# Altium schematic sheet Batt_Meas.SchDoc
size B
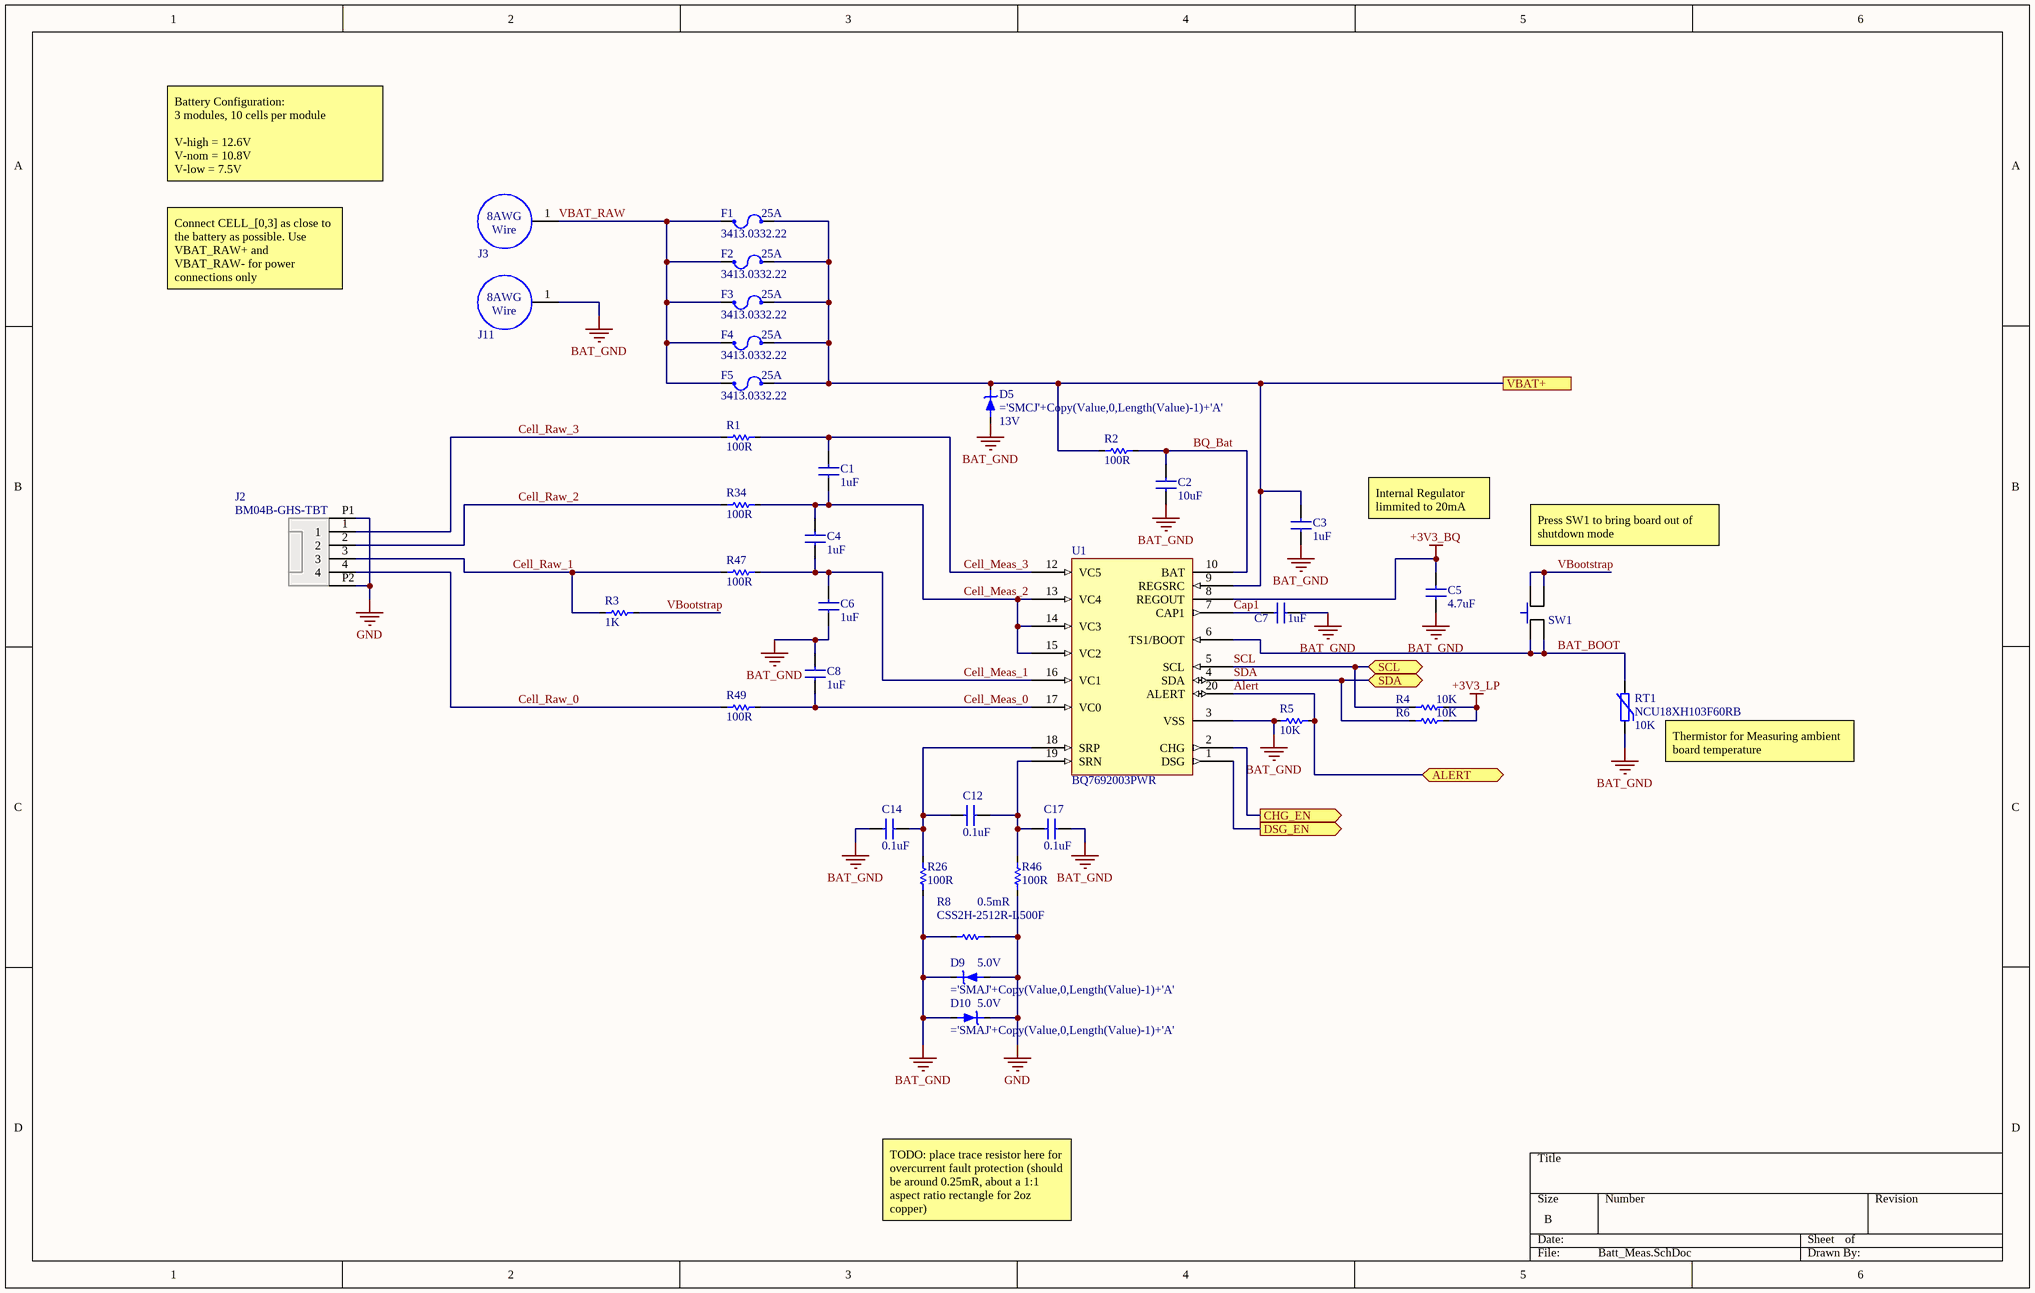
[diagram p0: Batt_Meas.SchDoc]

## Parts
C1  value 1uF  [0603_CAPACITOR]  (hidden comment: CAP 1uF 16V X7R)
C2  value 10uF  [1206_CAPACITOR]  (hidden comment: CAP 10uF 50V X5R)
C3  value 1uF  [0603_CAPACITOR]  (hidden comment: CAP 1uF 16V X7R)
C4  value 1uF  [0603_CAPACITOR]  (hidden comment: CAP 1uF 16V X7R)
C5  value 4.7uF  [0603_Capacitor]  (hidden comment: CAP 4.7uF 6.3V X5R)
C6  value 1uF  [0603_CAPACITOR]  (hidden comment: CAP 1uF 16V X7R)
C7  value 1uF  [0805_Capacitor]  (hidden comment: CAP 1uF 16V X7R)
C8  value 1uF  [0603_CAPACITOR]  (hidden comment: CAP 1uF 16V X7R)
C12  value 0.1uF  [0402_CAPACITOR]  (hidden comment: CAP 0.1uF 16V X7R)
C14  value 0.1uF  [0402_CAPACITOR]  (hidden comment: CAP 0.1uF 16V X7R)
C17  value 0.1uF  [0402_CAPACITOR]  (hidden comment: CAP 0.1uF 16V X7R)
D5  value 13V  [SMC]  (hidden comment: TVS Diode)
D9  value 5.0V  [SMA]  (hidden comment: TVS Diode)
D10  value 5.0V  [SMA]  (hidden comment: TVS Diode)
F1  3413.0332.22  value 25A  [1206_Fuse]
F2  3413.0332.22  value 25A  [1206_Fuse]
F3  3413.0332.22  value 25A  [1206_Fuse]
F4  3413.0332.22  value 25A  [1206_Fuse]
F5  3413.0332.22  value 25A  [1206_Fuse]
J2  BM04B-GHS-TBT  [J_BM04B-GHS-TBT]
J3  8AWG Wire To Board  [Wire_To_Board_8AWG_Red]  (value not drawn)
J11  8AWG Wire To Board  [Wire_To_Board_8AWG_Black]  (value not drawn)
R1  value 100R  [0402_Resistor]  (hidden comment: R_0402_100R_1%)
R2  value 100R  [0402_Resistor]  (hidden comment: R_0402_100R_1%)
R3  value 1K  [0402_Resistor]  (hidden comment: R_0402_1K_1%)
R4  value 10K  [0402_Resistor]  (hidden comment: R_0402_10K_1%)
R5  value 10K  [0402_Resistor]  (hidden comment: R_0402_10K_1%)
R6  value 10K  [0402_Resistor]  (hidden comment: R_0402_10K_1%)
R8  CSS2H-2512R-L500F  value 0.5mR  [2512_Resistor]
R26  value 100R  [0402_Resistor]  (hidden comment: R_0402_100R_1%)
R34  value 100R  [0402_Resistor]  (hidden comment: R_0402_100R_1%)
R46  value 100R  [0402_Resistor]  (hidden comment: R_0402_100R_1%)
R47  value 100R  [0402_Resistor]  (hidden comment: R_0402_100R_1%)
R49  value 100R  [0402_Resistor]  (hidden comment: R_0402_100R_1%)
RT1  NCU18XH103F60RB  value 10K  [0603_Resistor]
SW1  SW_TACT_SWITCH_6x6  [SW_6x6mm_SMD]  (value not drawn)
U1  BQ7692003PWR  [TSSOP-20]

## Ports
ALERT (bidir), CHG_EN (out), DSG_EN (out), SCL (bidir), SDA (bidir), VBAT+

## Nets
+3V3_BQ: C5.1 U1.8(REGOUT)
+3V3_LP: R4.1 R6.1
BAT_GND: C2.2 C3.2 C5.2 C6.2 C7.1 C8.1 C14.1 C17.2 D5.1(Anode) D9.2(Cathode) D10.1(Anode) J11.1 R5.1 R8.1 R26.2 RT1.1 U1.3(VSS)
GND: D9.1(Anode) D10.2(Cathode) J2.P1 J2.P2 R8.2 R46.2
Alert: R5.2 U1.20(ALERT) ; port ALERT
BAT_BOOT: RT1.2 SW1.1 SW1.4 U1.6(TS1/BOOT)
BQ_Bat: C2.1 R2.1 U1.10(BAT)
Cap1: C7.2 U1.7(CAP1)
Cell_Meas_0: C8.2 R49.2 U1.17(VC0)
Cell_Meas_1: C4.2 C6.1 R47.2 U1.16(VC1)
Cell_Meas_2: C1.2 C4.1 R34.2 U1.13(VC4) U1.14(VC3) U1.15(VC2)
Cell_Meas_3: C1.1 R1.2 U1.12(VC5)
Cell_Raw_0: J2.4 R49.1
Cell_Raw_1: J2.3 R3.1 R47.1
Cell_Raw_2: J2.2 R34.1
Cell_Raw_3: J2.1 R1.1
CHG_EN: U1.2(CHG) ; port CHG_EN
DSG_EN: U1.1(DSG) ; port DSG_EN
SCL: R4.2 U1.5(SCL) ; port SCL
SDA: R6.2 U1.4(SDA) ; port SDA
VBAT+: C3.1 D5.2(Cathode) F1.2 F2.2 F3.2 F4.2 F5.2 R2.2 U1.9(REGSRC) ; port VBAT+
VBAT_RAW: F1.1 F2.1 F3.1 F4.1 F5.1 J3.1
VBootstrap: R3.2 SW1.2 SW1.3
NetC12_1: C12.1 C14.2 R26.1 U1.18(SRP)
NetC12_2: C12.2 C17.1 R46.1 U1.19(SRN)

## Notes on the sheet
- Battery Configuration:
  3 modules, 10 cells per module
  V-high = 12.6V
  V-nom = 10.8V
  V-low = 7.5V
- Connect CELL_[0,3] as close to the battery as possible. Use VBAT_RAW+ and VBAT_RAW- for power connections only
- Internal Regulator limmited to 20mA
- Press SW1 to bring board out of shutdown mode
- (near RT1) Thermistor for Measuring ambient board temperature
- TODO: place trace resistor here for overcurrent fault protection (should be around 0.25mR, about a 1:1 aspect ratio rectangle for 2oz copper)
- (in symbol J_Wire_To_Board_8AWG) 8AWG; Wire

## Library data of the parts
C1 C3 C4 C6 C8 = C_0603_1uF_16V_10%: CAP CERM 1uF 10% 16V 0603; SVP Creator: Spencer Berglund; Package: =SelectedPackage; Voltage: 16V; Temperature Coefficient: X7R; Supplier 1: Digi-Key; Supplier Part Number 1: 1276-6524-6-ND
C2 = C_1206_10uF_50V_20%: CAP CERM 10uF 20% 50V 1206; SVP Creator: Spencer Berglund; Package: =SelectedPackage; Voltage: 50V; Temperature Coefficient: X5R; Supplier 1: Digi-Key; Supplier Part Number 1: 1276-6736-6-ND
C5 = C_0603_4.7uF_6.3V_10%: CAP CER 4.7UF 6.3V X5R 0603; Package: =SelectedPackage; Voltage: 6.3V; Temperature Coefficient: X5R; Supplier 1: Digi-Key; Supplier Part Number 1: 1276-1045-1-ND
C7 = C_0805_1uF_16V_10%: CAP CERM 1uF 10% 16V 0805; SVP Creator: Spencer Berglund; Package: =SelectedPackage; Voltage: 16V; Temperature Coefficient: X7R; Supplier 1: Digi-Key; Supplier Part Number 1: 1276-6471-1-ND
C12 C14 C17 = C_0402_0.1uF_16V_10%: CAP CERM 0.1uF 10% 16V 0402; Package: =SelectedPackage; Voltage: 16V; Temperature Coefficient: X7R; Supplier 1: Digi-Key; Supplier Part Number 1: 1276-1001-1-ND; Supplier 2: Digi-Key; Supplier Part Number 2: 587-1451-1-ND
D5 = D_TVS_SMCJ_Uni_generic: SMC Unidirectional TVS Diode; Manufacturer: Vishay; Power - Peak Pulse: 1500W; Type: Zener; Power - Dissipation: 6.5W; Operating Temperature: -55°C ~ 150°C; HelpURL: http://www.vishay.com/docs/88394/smcj.pdf; Manufacturer PN: ='SMCJ'+Copy(Value,0,Length(Value)-1)+'A'
D9 D10 = D_TVS_SMAJ_Uni_generic: SMA Unidirectional TVS Diode; Manufacturer: Vishay; Power - Peak Pulse: 400W; Type: Zener; Operating Temperature: -55°C ~ 150°C; HelpURL: http://www.vishay.com/docs/88392/smbj.pdf; Manufacturer PN: ='SMAJ'+Copy(Value,0,Length(Value)-1)+'A'
F1-F5 = F_3413.0332.22: FUSE BOARD MOUNT 25A 32VAC 63VDC; Response Time: Slow; Voltage Rating - AC: 32V; Voltage Rating - DC: 63V; Supplier 1: Digi-Key; Supplier Part Number 1: 486-1690-6-ND
J2 = J_BM04B-GHS-TBT: Connector Header Surface Mount 4 position 0.049" (1.25mm); Manufacturer: JST; Manufacturer Part Number: BM04B-GHS-TBT(LF)(SN); Current Rating: 1A; Gender: Male; Voltage Rating: 50V; Wire/Cable Gauge: 26AWG; Supplier 1: Digi-Key; Supplier Part Number 1: 455-1580-1-ND; Contact Material: Bronze; Contact Plating: Tin; Housing Color: Natural; Max Operating Temperature: 85°C; Min Operating Temperature: -25°C; Housing Material: Nylon; Voltage Rating (AC): 50V; Termination: Crimp; Pitch: 1.25mm; Orientation: Straight
J3 J11 = J_Wire_To_Board_8AWG: 8AWG Stranded Wire Thru-Hole Pad
R1-R6 R26 R34 R46 R47 R49 = R_0402_generic_1%: Generic 0402 Resistor (10.2R to 10M); Manufacturer: Yageo; Power Rating: 0.0625W; Temperature Coefficient: ±100ppm/°C; Tolerance: ±1%; Voltage Rating: 50V; Operating Temperature: -55°C ~ 155°C; Manufacturer Part Number: ='RC0402FR-07'+ValueFormatted+'L'; HelpURL: https://www.digikey.com/products/en/resistors/chip-resistor-surface-mount/52?pv17=103&FV=fffc000d%2Cc0001%2C1c0002%2C1f140000%2Cffe00034&k=RC0402; ValueFormatted: =Copy(Copy(Value, 0, Pos('.', Value)-1)+Copy(Value, Length(Value), 1)+Copy(Value, Pos('.', Value)+1, Length(Value)-Pos('.', Value)-1),1,Pos('.',Value)*Length(Value))+Copy(Value,1,Length(Value)*(1-Pos('.',Value)))
R8 = R_CSS2H-2512R-L500F: 500 µOhms ±1% 6W Chip Resistor 2512 (6432 Metric) Current Sense, Moisture Resistant Metal Element; Manufacturer: Bourns; Temperature Coefficient: 50ppm/°C; Supplier 1: Digi-Key; Supplier Part Number 1: CSS2H-2512R-L500FCT-ND; Min Operating Temperature: -55°C; Max Power Dissipation: 6W; Case/Package: 2512; Tolerance: 1%; Power Rating: 6W; Length: 0.25inch; Max Operating Temperature: 170°C; Manufacturer Part Number: CSS2H-2512R-L500F; Height: 0.037inch; Resistance: 0.5mR
RT1 = RT_NCU18XH103F60RB: NTC Thermistor 10k 0603 (1608 Metric); Manufacturer: Murata; Supplier 1: Digi-Key; Max Operating Temperature: 125°C; Min Operating Temperature: -40°C; Manufacturer Part Number: NCU18XH103F60RB; Supplier Part Number 1: 490-16279-6-ND
SW1 = SW_TACT_SWITCH_6x6: SWITCH TACT 6MM BLACK 160GF; SVP Creator: Spencer Berglund; Package: 6mm x 6mm; Supplier 1: Digi-Key; Supplier Part Number 1: CKN10425CT-ND
U1 = U_BQ7692003PWR: Battery Battery Monitor IC Multi-Chemistry 20-TSSOP; Supplier 1: Digi-Key; Supplier Part Number 1: 296-39959-6-ND